# Altium schematic sheet Motors.SchDoc
size A4; SheetNumber: 5; SheetTotal: 8
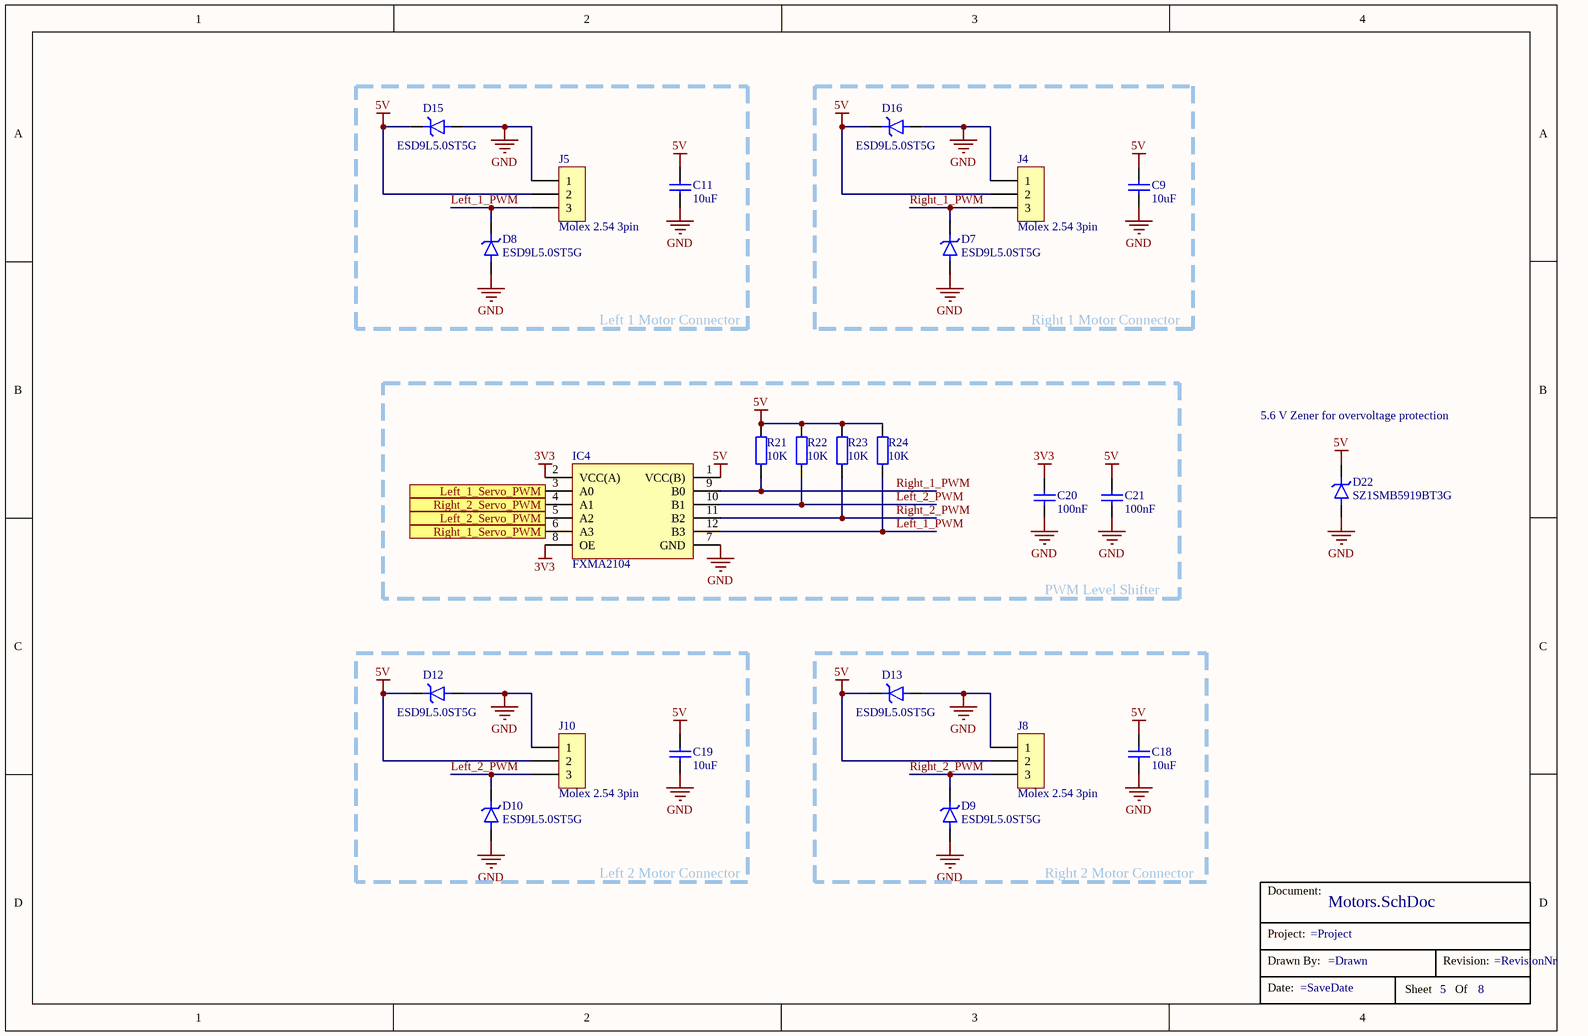
[diagram p0: Motors.SchDoc]

## Parts
*  TitleBox  (value not drawn)
C9  Capacitance: 10uF  [C1206 N]
C11  Capacitance: 10uF  [C1206 N]
C18  Capacitance: 10uF  [C1206 N]
C19  Capacitance: 10uF  [C1206 N]
C20  Capacitance: 100nF  [C0603 N]
C21  Capacitance: 100nF  [C0603 N]
D7  ESD9L5.0ST5G  [SOD923F, NOMINAL]
D8  ESD9L5.0ST5G  [SOD923F, NOMINAL]
D9  ESD9L5.0ST5G  [SOD923F, NOMINAL]
D10  ESD9L5.0ST5G  [SOD923F, NOMINAL]
D12  ESD9L5.0ST5G  [SOD923F, NOMINAL]
D13  ESD9L5.0ST5G  [SOD923F, NOMINAL]
D15  ESD9L5.0ST5G  [SOD923F, NOMINAL]
D16  ESD9L5.0ST5G  [SOD923F, NOMINAL]
D22  SZ1SMB5919BT3G  [DO-214, NOMINAL]
IC4  FXMA2104  [QFN12 1.8x1.8, NOMINAL]
J4  Molex 2.54 3pin  [22-27-2031]
J5  Molex 2.54 3pin  [22-27-2031]
J8  Molex 2.54 3pin  [22-27-2031]
J10  Molex 2.54 3pin  [22-27-2031]
R21  10K  [R0603]
R22  10K  [R0603]
R23  10K  [R0603]
R24  10K  [R0603]

## Blocks framed on the sheet
Left 1 Motor Connector: C11 D8 D15 J5
Right 1 Motor Connector: C9 D7 D16 J4
PWM Level Shifter: C20 C21 IC4 R21-R24
Left 2 Motor Connector: C19 D10 D12 J10
Right 2 Motor Connector: C18 D9 D13 J8

## Ports
Left_1_Servo_PWM (in), Left_2_Servo_PWM (in), Right_1_Servo_PWM (in), Right_2_Servo_PWM (in)

## Nets
3V3: C20.2 IC4.2(VCC(A)) IC4.8(OE)
5V: C9.2 C11.2 C18.2 C19.2 C21.2 D12.C D13.C D15.C D16.C D22.C IC4.1(VCC(B)) J4.2 J5.2 J8.2 J10.2 R21.2 R22.2 R23.2 R24.2
GND: C9.1 C11.1 C18.1 C19.1 C20.1 C21.1 D7.A D8.A D9.A D10.A D12.A D13.A D15.A D16.A D22.A IC4.7(GND) J4.1 J5.1 J8.1 J10.1
Left_1_PWM: D8.C IC4.12(B3) J5.3 R24.1
Left_1_Servo_PWM: IC4.3(A0) ; port Left_1_Servo_PWM
Left_2_PWM: D10.C IC4.10(B1) J10.3 R22.1
Left_2_Servo_PWM: IC4.5(A2) ; port Left_2_Servo_PWM
Right_1_PWM: D7.C IC4.9(B0) J4.3 R21.1
Right_1_Servo_PWM: IC4.6(A3) ; port Right_1_Servo_PWM
Right_2_PWM: D9.C IC4.11(B2) J8.3 R23.1
Right_2_Servo_PWM: IC4.4(A1) ; port Right_2_Servo_PWM

## Notes on the sheet
- 5.6 V Zener for overvoltage protection
- (in symbol TitleBox) Document:; Project:; Drawn By:; Revision:; Date:; Sheet; Of

## Library data of the parts
C9 C11 C18 C19 = Capacitor: Ceramic capacitor; Type: MLCC; Voltage rating: 25V; Characteristic: X7R; Manufacturer: *; Note: C1206 N
C20 C21 = Capacitor: Ceramic capacitor; Type: MLCC; Voltage rating: *V; Characteristic: *; Manufacturer: *; Note: C0603 N
D7-D10 D12 D13 D15 D16 = ESD9L5.0ST5G: TVS DIODE, Unidir, 5V/9.8V, 150mW, SOD-923, ESD9L5.0ST5G, ON SEMICONDUCTOR; Clamping Voltage: 9.8V; Reverse Standoff Voltage: 5V; Leakage Current: 1uA; Peak Pulse Current: 1A; Breakdown Voltage: 5.4 .. 5.8V; Supplier 1: Farnell; Manufacturer: ON Semiconductor; Manufacturer Part Number: ESD9L5.0ST5G; Operating Temperature Range: -55 .. 150°C; Operating Supply Voltage: 5V; Max Surge Current: 1A; Peak Pulse Power: 150mW; ComponentLink1URL: http://www.mouser.com/ds/2/308/ESD9L-D-278322.pdf?src-supplier=Mouser; ComponentLink1Description: Datasheet; Supplier 2: TME; Supplier Part Number 1: 1651639RL; Supplier Part Number 2: ESD9L5.0ST5G
D22 = SZ1SMB5918BT3G: ZENER, 5.1V, 3W, SOD-123, ON SEMICONDUCTOR, SZ1SMB5918BT3G; ComponentLink1Description: Datasheet; ComponentLink1URL: http://www.farnell.com/datasheets/2160707.pdf?_ga=2.214989202.465896120.1585759027-1429076973.1585049483
IC4 = FXMA2104: Level shifter, 4 inputs, 1.65 .. 5.5Vin, 3ns delay, FXMA2104, ON SEMICONDUCTOR; Supplier 1: Farnell; Supplier Part Number 1: 2822577; ComponentLink1Description: Datasheet; ComponentLink1URL: http://www.farnell.com/datasheets/2552660.pdf?_ga=2.61529188.991561592.1575804886-1961576694.1568451101
J4 J5 J8 J10 = Molex header, 3 pin, KK 6410 series: Current Rating: 4A; Supplier 1: Farnell; Manufacturer Part Number: 22-27-2031; Product Range: KK 6410 Series; ComponentLink1URL: http://www.farnell.com/datasheets/1023435.pdf; ComponentLink1Description: Datasheet; ComponentLink2URL: http://www.farnell.com/cad/1595526.pdf; ComponentLink2Description: Drawing; Supplier 2: Mouser; Supplier 3: TME; Supplier Part Number 1: 9731156; Supplier Part Number 2: 538-22-27-2031; Supplier Part Number 3: MX-6410-03A
R21-R24 = Resistor: Precision: *%; Voltage rating: *V; Temp coefficient: *ppm; Power rating: *mW; Manufacturer: *; Resistance: 10K; Note: R0603